# EAGLE design POE_V1 (EAGLE 9.6.2)
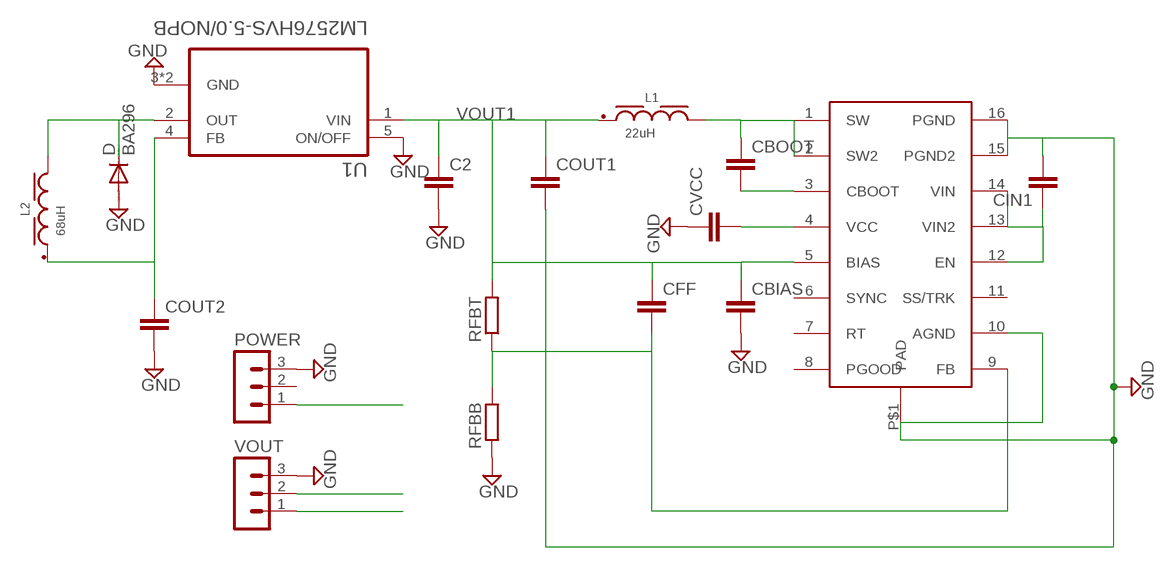
[diagram p0: schematic, sheet 1]

## Parts
C2  C-EUC1206  [C1206]
CBIAS  C-EUC1206  [C1206]
CBOOT  C-EUC1206  [C1206]
CFF  C-EUC1206  [C1206]
CIN1  C-EUC1206  [C1206]
COUT1  C-EUC1206  [C1206]
COUT2  C-EUC1206  [C1206]
CVCC  C-EUC1206  [C1206]
D  BA296  [P2-15]
L1  22uH  WE-PD_1260_744771122  [WE-PD_1260]
L2  68uH  WE-PD_1210_7447709680  [WE-PD_1210]
POWER  MA03-1  [MA03-1]
RFBB  R-EU_M1206  [M1206]
RFBT  R-EU_M1206  [M1206]
U1  LM2576HVS-5.0/NOPB  [VREG_TPS79625KTTR]
U$1  LM46002  [TSSOP16]
VOUT  MA03-1  [MA03-1]

## Nets
GND: C2.2 CBIAS.2 CIN1.2 COUT1.2 COUT2.2 CVCC.1 D.A POWER.3 RFBB.1 U1.3(GND) U1.5(ON/OFF) U1.6(GND) U$1.10(AGND) U$1.15(PGND2) U$1.16(PGND) U$1.P$1(PAD) VOUT.3
N$1: CBOOT.1 L1.2 U$1.1(SW) U$1.2(SW2)
N$2: CBOOT.2 U$1.3(CBOOT)
N$3: CVCC.2 U$1.4(VCC)
N$6: D.C L2.2 U1.2(OUT)
RFBT: CFF.2 RFBB.2 RFBT.1 U$1.9(FB)
VIN: CIN1.1 POWER.1 U$1.12(EN) U$1.13(VIN2) U$1.14(VIN)
VOUT1: C2.1 CBIAS.1 CFF.1 COUT1.1 L1.1 RFBT.2 U1.1(VIN) U$1.5(BIAS) VOUT.1
VOUT2: COUT2.1 L2.1 U1.4(FB) VOUT.2
Unconnected: POWER.2 U$1.6(SYNC) U$1.7(RT) U$1.8(PGOOD) U$1.11(SS/TRK)

## Library data of the parts
C2 CBIAS CBOOT CFF CIN1 COUT1 COUT2 CVCC = rcl:C-EU: CAPACITOR, European symbol
D = diode:BA296: DIODE
L1 = Eagle_WE-PD (rev20a):WE-PD_1260: WE-PD SMT Power Inductor Characteristics AECQ 200 Qualified Ultra low RDC and RAC Highest possible saturation current based on Ferrite Suitable for switching frequency up to 10MHz Temperature dependent parameter available on Redexpert Operating Temperature from -40°C to +125°C / +150°C Types WE-PD: Since always with low loss material, tight tolerances and high saturation behavior compared to other manufacturers in the market WE-PD Robust: Plastic base improves the mechanical stability and efficiency WE-PD Performance: MnZn core improves Saturation and RDC for highest efficiency Applications Switch Mode Power supplies from 0,1W up to 300W Integrated DC DC Converter Ideal for Switch Mode Power supplies with extreme high efficiency (>95%) <https://www.we-online.com/catalog/media/o14825v209%20Family_WE-PD.jpg> Details see: https://www.we-online.com/catalog/en/WE-PD/ Updated by Yingchun,Shan 2019-07-25 2019 (C) Wurth Elektronik; DATASHEET-URL: https://www.we-online.com/catalog/datasheet/744771122.pdf; FRES: 13.5MHz; IR: 3.37A; ISAT: 3.77A; MOUNT: SMT; PART-NUMBER: 744771122; RDC-MAX: 36mOhm; RDC-TYP: 31mOhm; VERSION: Standard
L2 = Eagle_WE-PD (rev20a):WE-PD_1210: WE-PD SMT Power Inductor Characteristics AECQ 200 Qualified Ultra low RDC and RAC Highest possible saturation current based on Ferrite Suitable for switching frequency up to 10MHz Temperature dependent parameter available on Redexpert Operating Temperature from -40°C to +125°C / +150°C Types WE-PD: Since always with low loss material, tight tolerances and high saturation behavior compared to other manufacturers in the market WE-PD Robust: Plastic base improves the mechanical stability and efficiency WE-PD Performance: MnZn core improves Saturation and RDC for highest efficiency Applications Switch Mode Power supplies from 0,1W up to 300W Integrated DC DC Converter Ideal for Switch Mode Power supplies with extreme high efficiency (>95%) <https://www.we-online.com/catalog/media/o14825v209%20Family_WE-PD.jpg> Details see: https://www.we-online.com/catalog/en/WE-PD/ Details see: https://katalog.we-online.com/en/pbs/WE-PD Updated by Yingchun,Shan 2019-07-25 2019 (C) Wurth Elektronik; DATASHEET-URL: https://www.we-online.com/catalog/datasheet/7447709680.pdf; FRES: 5.5MHz; IR: 3.2A; ISAT: 3.6A; MOUNT: SMT; PART-NUMBER: 7447709680; RDC-MAX: 89mOhm; RDC-TYP: 69mOhm; VERSION: Standard
POWER VOUT = con-lstb:MA03-1: PIN HEADER; OC_FARNELL: unknown; OC_NEWARK: unknown
RFBB RFBT = resistor:R-EU_: RESISTOR, European symbol
U1 = LM2576HVS-5.0_NOPB:LM2576HVS-5.0/NOPB; DESCRIPTION: SIMPLE SWITCHER&reg; 4V to 60V, 3A Low Component Count Step-Down Regulator 5-DDPAK/TO-263 -40 to 125; DIGI-KEY_PART_NUMBER: LM2576HVS-5.0/NOPB-ND; MF: Texas Instruments; MP: LM2576HVS-5.0/NOPB; PACKAGE: TO-263-5 Texas Instruments; PURCHASE-URL: https://pricing.snapeda.com/search/part/LM2576HVS-5.0/NOPB/?ref=eda
U$1 = analog-devices-3:LM46002

## Board
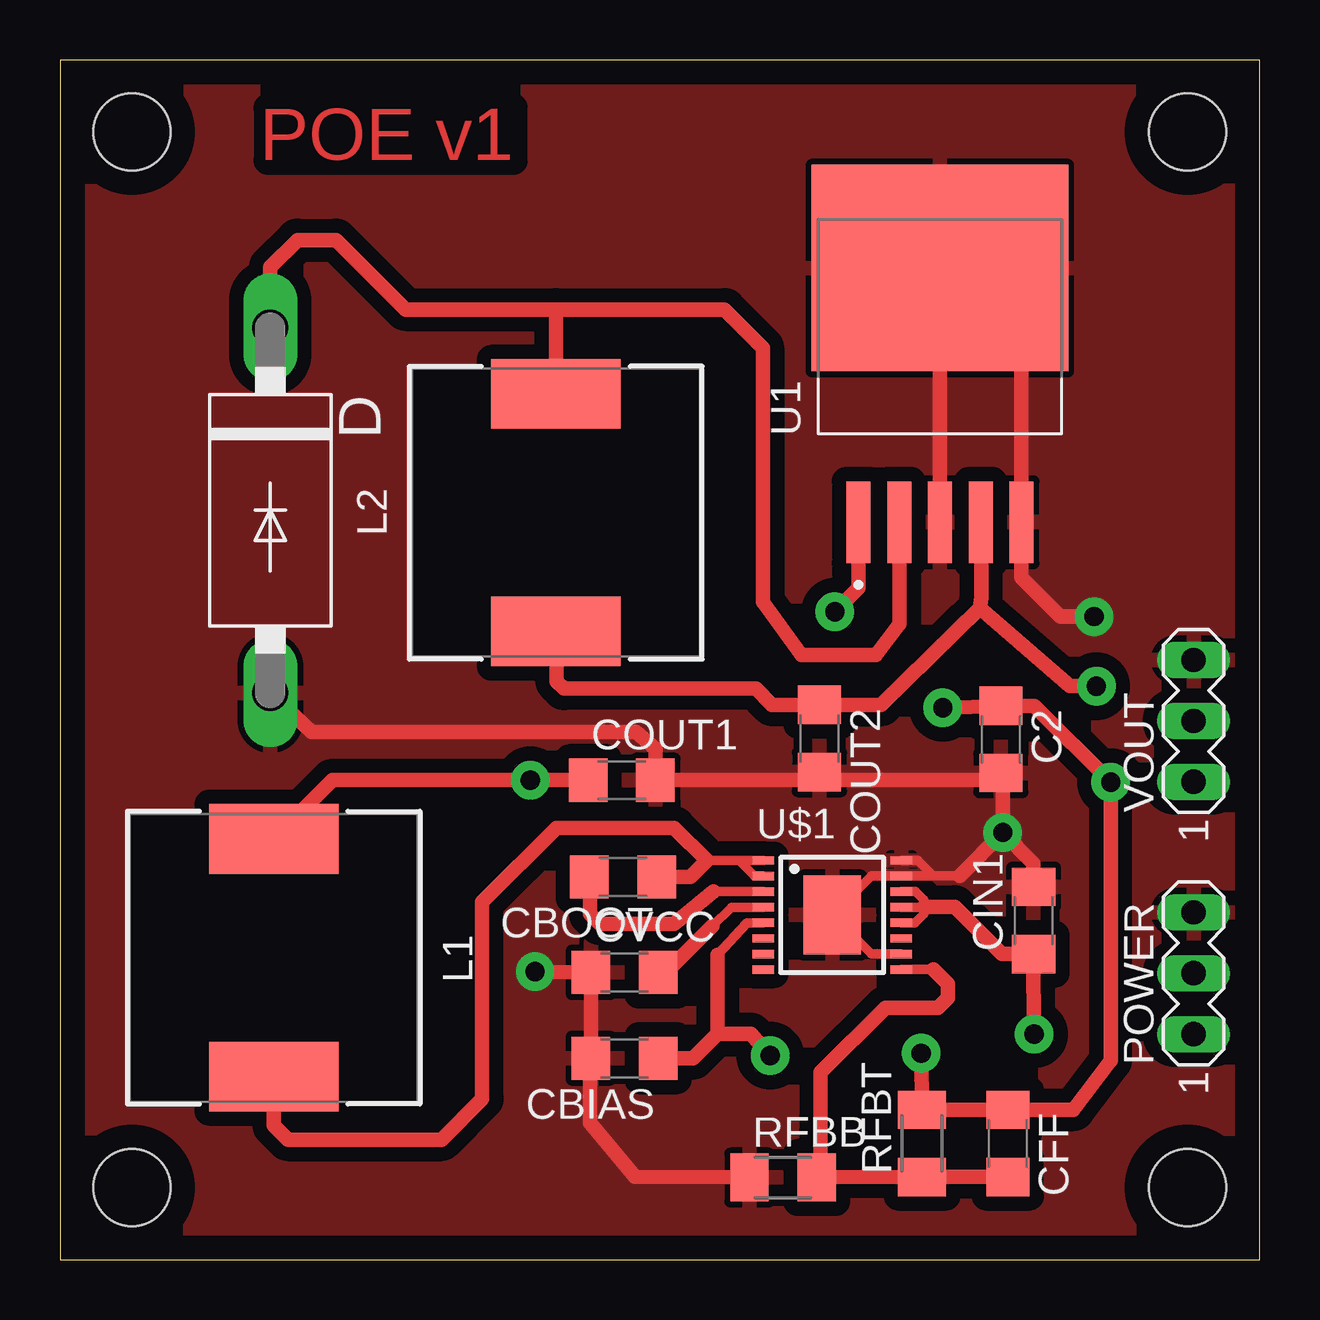
[diagram p1: board, top side]
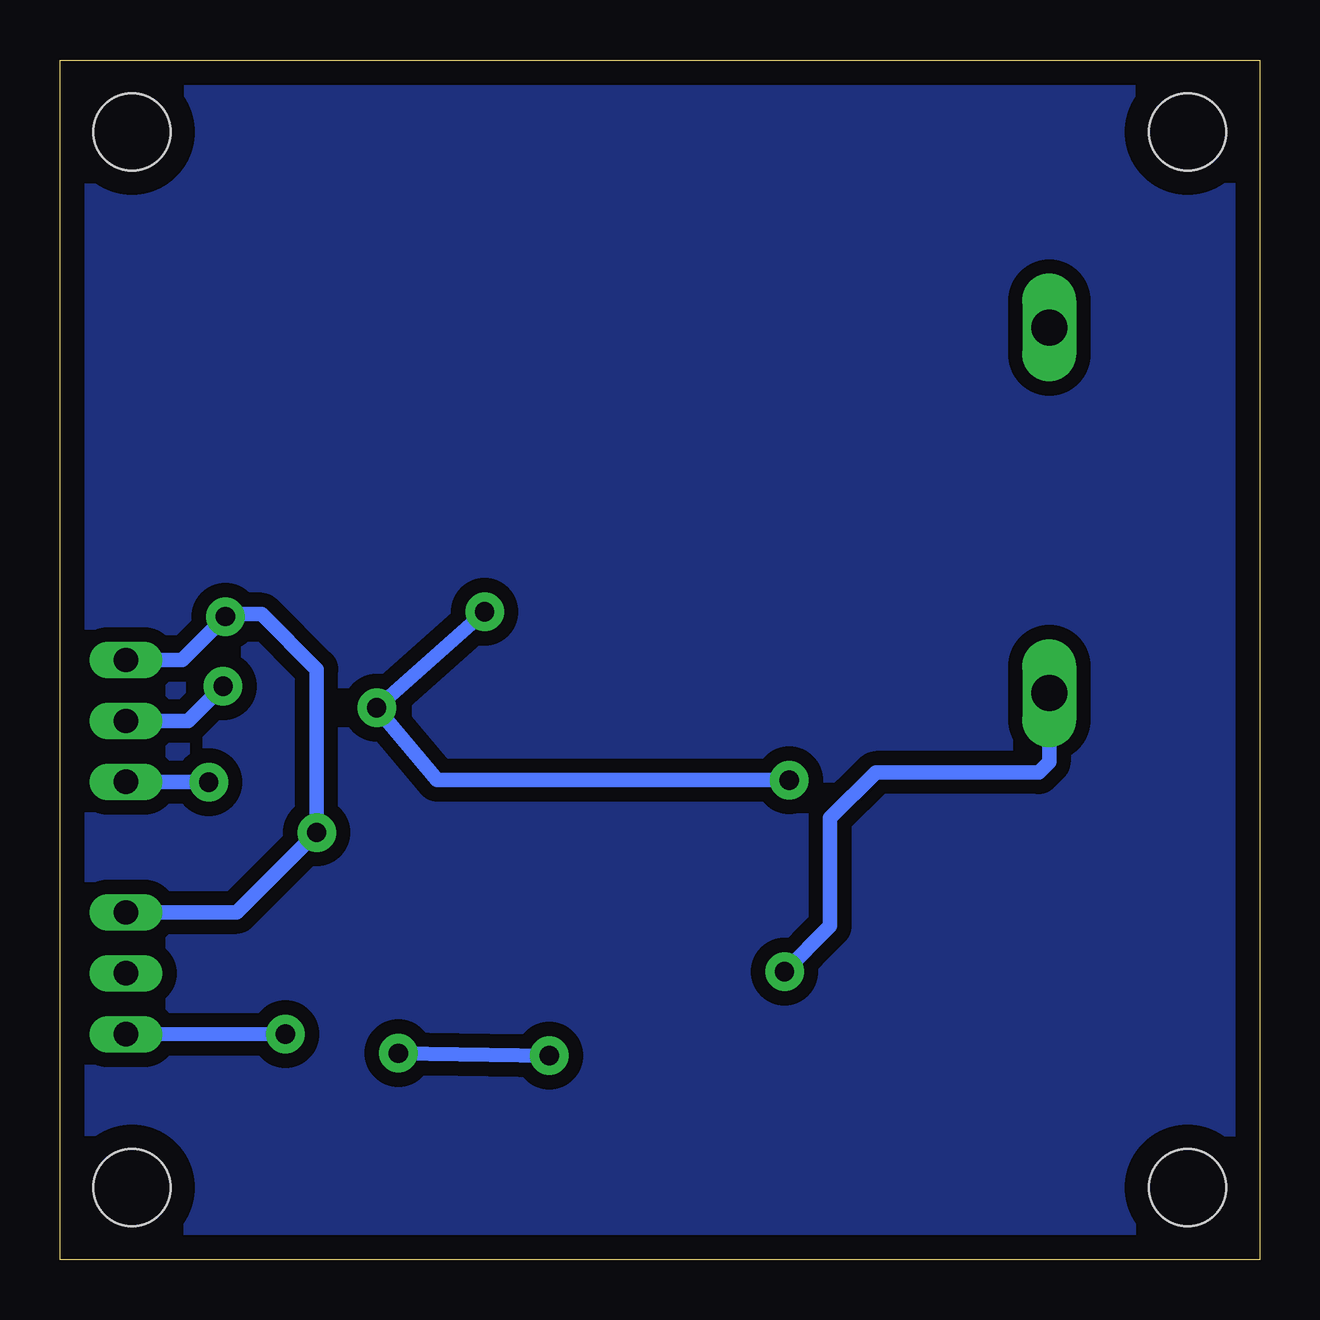
[diagram p2: board, bottom side, seen from below]

Size 50 x 50 mm. Coordinates in mm from the lower left corner, seen from the top.
Outline: 0,0 50,0 50,50 0,50 0,0
Copper layers (1*16): Top 0.035mm / dielectric 1.5mm / Bottom 0.035mm
Design rules "default *": minimum track width 0.6mm, minimum drill 24mil, track to track 0.6mm, track to pad 0.6mm, pad to pad 0.6mm, via to via 0.6mm, smd to smd 0.6mm, copper to edge 40mil, drill to drill 8mil, minimum pad ring 10mil, minimum via ring 8mil, stop-mask expansion 4mil, vias tented up to drill 0mil, thermal gap 10mil
Holes 3.2 mm at 47,3 3,3 3,47 47,47

### Footprints (pad centres in the part's own frame; a part is rotated, then mirrored left to right if it is on the bottom)
C1206 = smd 1.6 x 1.8: 1 -1.4,0; 2 1.4,0
P2-15 = drill 1.499 long: A 7.62,0; C -7.62,0
WE-PD_1260 = smd 2.9 x 5.4: 1 -4.95,0; 2 4.95,0
WE-PD_1210 = smd 2.9 x 5.4: 1 -4.95,0; 2 4.95,0
MA03-1 = drill 1.016 long: 1 -2.54,0; 2 0,0; 3 2.54,0
M1206 = smd 1.6 x 2: 1 -1.4,0; 2 1.4,0
VREG_TPS79625KTTR = smd 3.4 x 1: 1 -10.6,3.4; 2 -10.6,1.7; 3 -10.6,0; 4 -10.6,-1.7; 5 -10.6,-3.4 | smd 8.6 x 10.7: 6 0,0
TSSOP16 = smd 0.9 x 0.35: 1 -2.875,2.275; 2 -2.875,1.625; 3 -2.875,0.975; 4 -2.875,0.325; 5 -2.875,-0.325; 6 -2.875,-0.975; 7 -2.875,-1.625; 8 -2.875,-2.275; 9 2.875,-2.275; 10 2.875,-1.625; 11 2.875,-0.975; 12 2.875,-0.325; 13 2.875,0.325; 14 2.875,0.975; 15 2.875,1.625; 16 2.875,2.275 | smd 2.41 x 3.29: P$1 0,0

### Placement (x,y rotation side)
C2  39.22,21.68 270 top
CBIAS  23.53,8.39 180 top
CBOOT  23.47,15.95 180 top
CFF  39.51,4.84 270 top
CIN1  40.58,14.13 90 top
COUT1  23.42,19.98 0 top
COUT2  31.66,21.72 270 top
CVCC  23.53,11.97 0 top
D  8.77,31.23 270 top
L1  8.91,12.58 270 top
L2  20.67,31.13 90 top
POWER  47.25,11.93 90 top
RFBB  30.14,3.42 0 top
RFBT  35.93,4.84 90 top
U1  36.68,41.33 90 top
U$1  32.19,14.36 0 top
VOUT  47.25,22.45 90 top

### Tracks (layer width: path | path; a pad name or v marks a point on that pad's centre or on a via)
GND  (via drill 0.8 pad 1.6)
  Top 0.4: U$1.16 35.77,16.64 36.4,16 | 36.4,16 35.08,16 U$1.15 33.81,15.98 32.56,14.73 U$1.P$1 33.81,12.73 U$1.10 | 36.4,16 37.5,16
  Top 0.6: RFBB.1 23.96,3.44 22.1,5.7 22.1,8.36 CBIAS.2 CVCC.1 v19.8,12 | U1.6 36.68,39.4 | 36.68,39.4 U1.3 36.8,30.61 | 36.68,39.4 37.48,38.6 40,38.6 40.08,38.52 U1.5 40.08,28.42 41.7,26.8 v43.1,26.8 | 39.18,20.32 C2.2 | 32.1,15.2 32.56,14.73 | 31.32,19.98 COUT1.2 24.82,21.28 24,22 10.48,22 D.A | 31.32,19.98 COUT2.2 | 31.32,19.98 38.92,19.98 C2.2 | v39.3,17.8 39.3,20.2 C2.2 | CIN1.2 40.58,16.52 v39.3,17.8 | 37.5,16 v39.3,17.8
  Bottom 0.6: VOUT.3 44.91,24.99 v43.1,26.8 43,26.9 41.6,26.9 39.3,24.6 v39.3,17.8 42.63,14.47 POWER.3 | D.A 8.77,20.73 9.2,20.3 16,20.3 17.9,18.4 17.9,13.9 v19.8,12
  pour Top: 0.6,49.4 49.4,49.4 49.4,0.5 0.5,0.5
N$1
  Top 0.4: U$1.1 28.3,16.64 | 28.3,16.64 26.96,16.64 | U$1.2 28.95,15.98 28.3,16.64
  Top 0.6: L1.2 8.91,5.59 9.5,5 15.9,5 17.6,6.7 17.6,14.9 20.7,18 23.9,18 25.6,18 26.96,16.64 26.28,15.95 CBOOT.1
N$2
  Top 0.4: U$1.3 27.23,15.34
  Top 0.6: CBOOT.2 22.1,15.92 22.1,14.4 22.5,14 25.6,14 27.23,15.34
N$3
  Top 0.4: U$1.4 27.98,14.69 27.2,13.9
  Top 0.6: CVCC.2 25.27,11.97 27.2,13.9
N$4
  pour Bottom: 0.7,49.3 0.7,0.7 49.3,0.7 49.3,49.3
N$6
  Top 0.6: U1.2 34.98,26.48 34,25.2 30.9,25.2 29.3,27.4 29.3,38 27.7,39.6 20.67,39.6 | D.C 8.77,41.37 9.9,42.5 11.5,42.5 14.4,39.6 20.67,39.6 | L2.2 20.67,39.6
RFBT
  Top 0.4: U$1.9 36.41,12.09
  Top 0.6: CFF.2 RFBT.1 RFBB.2 31.7,4.36 31.7,7.8 34.4,10.5 36.6,10.5 37,10.9 37,11.5 36.41,12.09
VIN  (via drill 0.8 pad 1.6)
  Top 0.4: U$1.14 35.66,15.34 36,15 36,14.7 36,14.69 | U$1.12 35.63,14.04 36,14.4 36,14.69 | 36,14.69 U$1.13
  Top 0.6: v40.6,9.4 CIN1.1 39.27,12.73 37.3,14.7 36,14.7
  Bottom 0.6: POWER.1 v40.6,9.4
VOUT1  (via drill 0.8 pad 1.6)
  Top 0.4: U$1.5 28.64,14.04 27.4,12.7
  Top 0.6: C2.1 40.62,23.08 v43.8,19.9 43.8,8.3 42.24,6.24 CFF.1 RFBT.2 v35.9,8.6 | COUT1.1 v19.6,19.98 11.36,19.98 L1.1 | 27.4,12.7 27.4,9.4 | CBIAS.1 26.39,8.39 27.4,9.4 | 27.4,9.4 28.8,9.4 v29.6,8.5 | 39.2,23.1 C2.1 | C2.1 v36.8,23 | U1.1 33.28,27.98 v32.3,27
  Bottom 0.6: VOUT.1 v43.8,19.9 | v35.9,8.6 v29.6,8.5 | v32.3,27 v36.8,23 34.28,19.98 v19.6,19.98
VOUT2  (via drill 0.8 pad 1.6)
  Top 0.6: v43.2,23.9 42.1,23.9 38.35,27.15 | 38.35,27.15 38.4,27.6 38.4,30.71 U1.4 | 38.35,27.15 34.22,23.12 COUT2.1 29.68,23.12 29,23.8 21,23.8 20.7,24.1 20.7,26.15 L2.1
  Bottom 0.6: VOUT.2 44.65,22.45 v43.2,23.9

### Text on the board
Top: POE v1